# EAGLE schematic main_board (EAGLE 7.1.0)
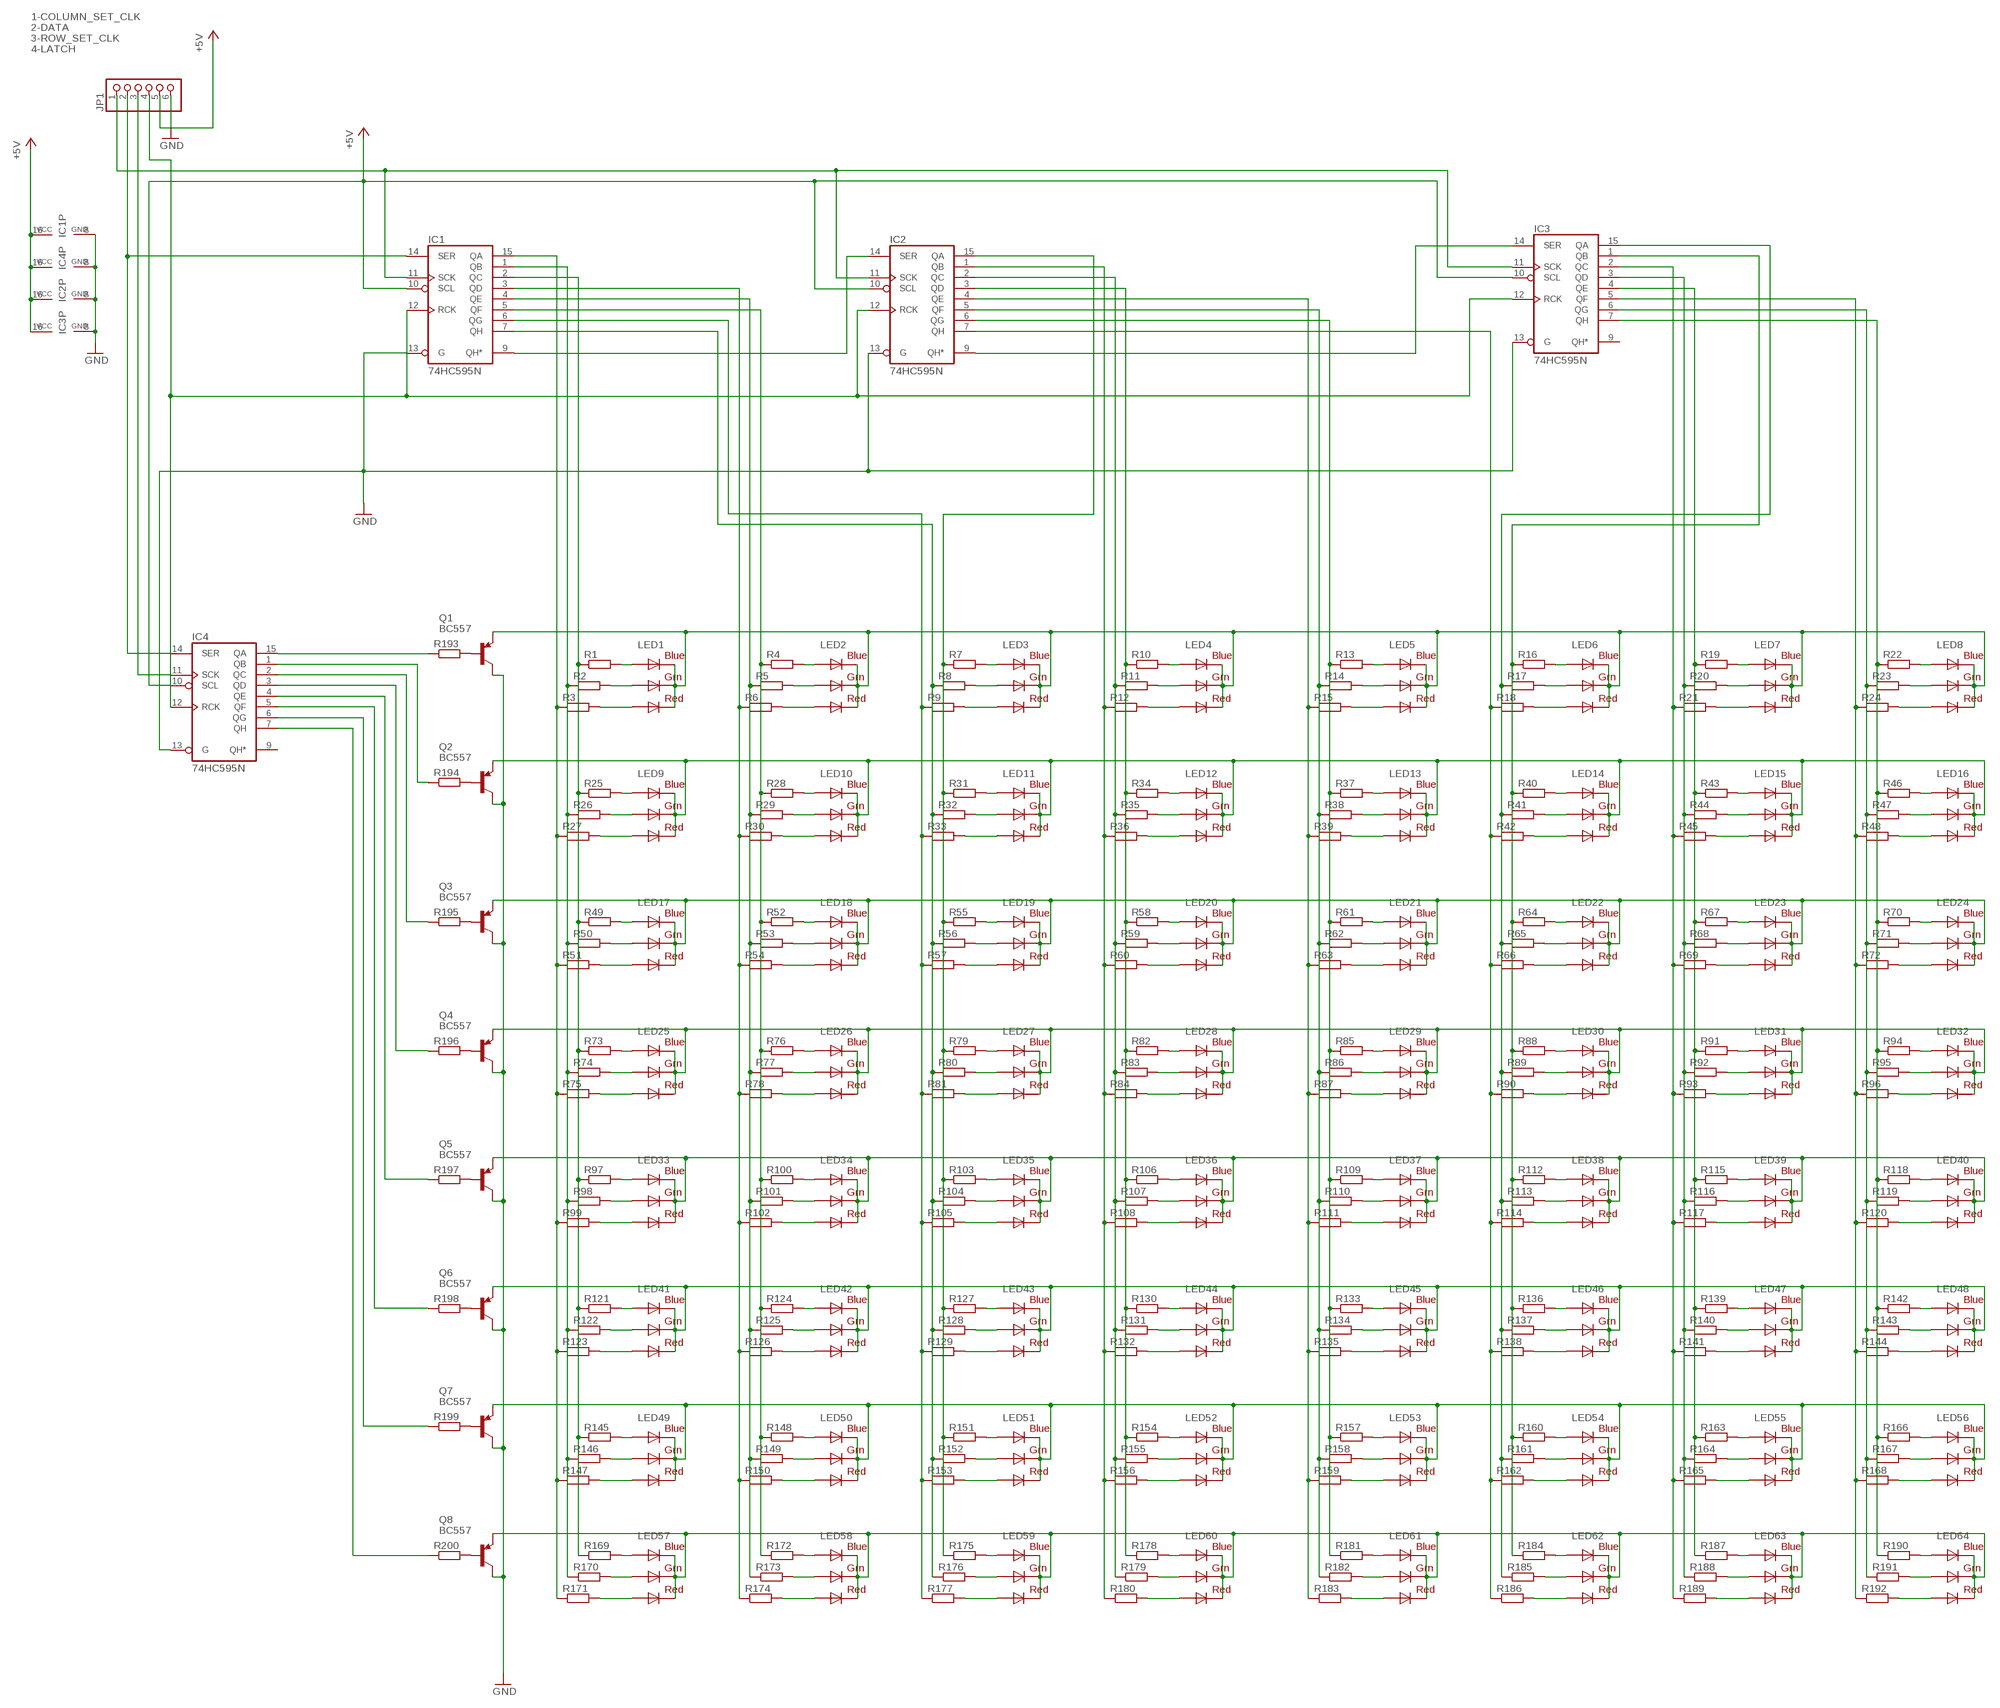
[diagram p0: schematic, sheet 1]

## Parts
IC1  74HC595N  [DIL16]
IC2  74HC595N  [DIL16]
IC3  74HC595N  [DIL16]
IC4  74HC595N  [DIL16]
JP1  PINHD-1X6  [1X06]
LED1  RGBLED5050  [RGBLED5050]
LED2  RGBLED5050  [RGBLED5050]
LED3  RGBLED5050  [RGBLED5050]
LED4  RGBLED5050  [RGBLED5050]
LED5  RGBLED5050  [RGBLED5050]
LED6  RGBLED5050  [RGBLED5050]
LED7  RGBLED5050  [RGBLED5050]
LED8  RGBLED5050  [RGBLED5050]
LED9  RGBLED5050  [RGBLED5050]
LED10  RGBLED5050  [RGBLED5050]
LED11  RGBLED5050  [RGBLED5050]
LED12  RGBLED5050  [RGBLED5050]
LED13  RGBLED5050  [RGBLED5050]
LED14  RGBLED5050  [RGBLED5050]
LED15  RGBLED5050  [RGBLED5050]
LED16  RGBLED5050  [RGBLED5050]
LED17  RGBLED5050  [RGBLED5050]
LED18  RGBLED5050  [RGBLED5050]
LED19  RGBLED5050  [RGBLED5050]
LED20  RGBLED5050  [RGBLED5050]
LED21  RGBLED5050  [RGBLED5050]
LED22  RGBLED5050  [RGBLED5050]
LED23  RGBLED5050  [RGBLED5050]
LED24  RGBLED5050  [RGBLED5050]
LED25  RGBLED5050  [RGBLED5050]
LED26  RGBLED5050  [RGBLED5050]
LED27  RGBLED5050  [RGBLED5050]
LED28  RGBLED5050  [RGBLED5050]
LED29  RGBLED5050  [RGBLED5050]
LED30  RGBLED5050  [RGBLED5050]
LED31  RGBLED5050  [RGBLED5050]
LED32  RGBLED5050  [RGBLED5050]
LED33  RGBLED5050  [RGBLED5050]
LED34  RGBLED5050  [RGBLED5050]
LED35  RGBLED5050  [RGBLED5050]
LED36  RGBLED5050  [RGBLED5050]
LED37  RGBLED5050  [RGBLED5050]
LED38  RGBLED5050  [RGBLED5050]
LED39  RGBLED5050  [RGBLED5050]
LED40  RGBLED5050  [RGBLED5050]
LED41  RGBLED5050  [RGBLED5050]
LED42  RGBLED5050  [RGBLED5050]
LED43  RGBLED5050  [RGBLED5050]
LED44  RGBLED5050  [RGBLED5050]
LED45  RGBLED5050  [RGBLED5050]
LED46  RGBLED5050  [RGBLED5050]
LED47  RGBLED5050  [RGBLED5050]
LED48  RGBLED5050  [RGBLED5050]
LED49  RGBLED5050  [RGBLED5050]
LED50  RGBLED5050  [RGBLED5050]
LED51  RGBLED5050  [RGBLED5050]
LED52  RGBLED5050  [RGBLED5050]
LED53  RGBLED5050  [RGBLED5050]
LED54  RGBLED5050  [RGBLED5050]
LED55  RGBLED5050  [RGBLED5050]
LED56  RGBLED5050  [RGBLED5050]
LED57  RGBLED5050  [RGBLED5050]
LED58  RGBLED5050  [RGBLED5050]
LED59  RGBLED5050  [RGBLED5050]
LED60  RGBLED5050  [RGBLED5050]
LED61  RGBLED5050  [RGBLED5050]
LED62  RGBLED5050  [RGBLED5050]
LED63  RGBLED5050  [RGBLED5050]
LED64  RGBLED5050  [RGBLED5050]
Q1  BC557  [TO92]
Q2  BC557  [TO92]
Q3  BC557  [TO92]
Q4  BC557  [TO92]
Q5  BC557  [TO92]
Q6  BC557  [TO92]
Q7  BC557  [TO92]
Q8  BC557  [TO92]
R1  R-EU_R0805  [R0805]
R2  R-EU_R0805  [R0805]
R3  R-EU_R0805  [R0805]
R4  R-EU_R0805  [R0805]
R5  R-EU_R0805  [R0805]
R6  R-EU_R0805  [R0805]
R7  R-EU_R0805  [R0805]
R8  R-EU_R0805  [R0805]
R9  R-EU_R0805  [R0805]
R10  R-EU_R0805  [R0805]
R11  R-EU_R0805  [R0805]
R12  R-EU_R0805  [R0805]
R13  R-EU_R0805  [R0805]
R14  R-EU_R0805  [R0805]
R15  R-EU_R0805  [R0805]
R16  R-EU_R0805  [R0805]
R17  R-EU_R0805  [R0805]
R18  R-EU_R0805  [R0805]
R19  R-EU_R0805  [R0805]
R20  R-EU_R0805  [R0805]
R21  R-EU_R0805  [R0805]
R22  R-EU_R0805  [R0805]
R23  R-EU_R0805  [R0805]
R24  R-EU_R0805  [R0805]
R25  R-EU_R0805  [R0805]
R26  R-EU_R0805  [R0805]
R27  R-EU_R0805  [R0805]
R28  R-EU_R0805  [R0805]
R29  R-EU_R0805  [R0805]
R30  R-EU_R0805  [R0805]
R31  R-EU_R0805  [R0805]
R32  R-EU_R0805  [R0805]
R33  R-EU_R0805  [R0805]
R34  R-EU_R0805  [R0805]
R35  R-EU_R0805  [R0805]
R36  R-EU_R0805  [R0805]
R37  R-EU_R0805  [R0805]
R38  R-EU_R0805  [R0805]
R39  R-EU_R0805  [R0805]
R40  R-EU_R0805  [R0805]
R41  R-EU_R0805  [R0805]
R42  R-EU_R0805  [R0805]
R43  R-EU_R0805  [R0805]
R44  R-EU_R0805  [R0805]
R45  R-EU_R0805  [R0805]
R46  R-EU_R0805  [R0805]
R47  R-EU_R0805  [R0805]
R48  R-EU_R0805  [R0805]
R49  R-EU_R0805  [R0805]
R50  R-EU_R0805  [R0805]
R51  R-EU_R0805  [R0805]
R52  R-EU_R0805  [R0805]
R53  R-EU_R0805  [R0805]
R54  R-EU_R0805  [R0805]
R55  R-EU_R0805  [R0805]
R56  R-EU_R0805  [R0805]
R57  R-EU_R0805  [R0805]
R58  R-EU_R0805  [R0805]
R59  R-EU_R0805  [R0805]
R60  R-EU_R0805  [R0805]
R61  R-EU_R0805  [R0805]
R62  R-EU_R0805  [R0805]
R63  R-EU_R0805  [R0805]
R64  R-EU_R0805  [R0805]
R65  R-EU_R0805  [R0805]
R66  R-EU_R0805  [R0805]
R67  R-EU_R0805  [R0805]
R68  R-EU_R0805  [R0805]
R69  R-EU_R0805  [R0805]
R70  R-EU_R0805  [R0805]
R71  R-EU_R0805  [R0805]
R72  R-EU_R0805  [R0805]
R73  R-EU_R0805  [R0805]
R74  R-EU_R0805  [R0805]
R75  R-EU_R0805  [R0805]
R76  R-EU_R0805  [R0805]
R77  R-EU_R0805  [R0805]
R78  R-EU_R0805  [R0805]
R79  R-EU_R0805  [R0805]
R80  R-EU_R0805  [R0805]
R81  R-EU_R0805  [R0805]
R82  R-EU_R0805  [R0805]
R83  R-EU_R0805  [R0805]
R84  R-EU_R0805  [R0805]
R85  R-EU_R0805  [R0805]
R86  R-EU_R0805  [R0805]
R87  R-EU_R0805  [R0805]
R88  R-EU_R0805  [R0805]
R89  R-EU_R0805  [R0805]
R90  R-EU_R0805  [R0805]
R91  R-EU_R0805  [R0805]
R92  R-EU_R0805  [R0805]
R93  R-EU_R0805  [R0805]
R94  R-EU_R0805  [R0805]
R95  R-EU_R0805  [R0805]
R96  R-EU_R0805  [R0805]
R97  R-EU_R0805  [R0805]
R98  R-EU_R0805  [R0805]
R99  R-EU_R0805  [R0805]
R100  R-EU_R0805  [R0805]
R101  R-EU_R0805  [R0805]
R102  R-EU_R0805  [R0805]
R103  R-EU_R0805  [R0805]
R104  R-EU_R0805  [R0805]
R105  R-EU_R0805  [R0805]
R106  R-EU_R0805  [R0805]
R107  R-EU_R0805  [R0805]
R108  R-EU_R0805  [R0805]
R109  R-EU_R0805  [R0805]
R110  R-EU_R0805  [R0805]
R111  R-EU_R0805  [R0805]
R112  R-EU_R0805  [R0805]
R113  R-EU_R0805  [R0805]
R114  R-EU_R0805  [R0805]
R115  R-EU_R0805  [R0805]
R116  R-EU_R0805  [R0805]
R117  R-EU_R0805  [R0805]
R118  R-EU_R0805  [R0805]
R119  R-EU_R0805  [R0805]
R120  R-EU_R0805  [R0805]
R121  R-EU_R0805  [R0805]
R122  R-EU_R0805  [R0805]
R123  R-EU_R0805  [R0805]
R124  R-EU_R0805  [R0805]
R125  R-EU_R0805  [R0805]
R126  R-EU_R0805  [R0805]
R127  R-EU_R0805  [R0805]
R128  R-EU_R0805  [R0805]
R129  R-EU_R0805  [R0805]
R130  R-EU_R0805  [R0805]
R131  R-EU_R0805  [R0805]
R132  R-EU_R0805  [R0805]
R133  R-EU_R0805  [R0805]
R134  R-EU_R0805  [R0805]
R135  R-EU_R0805  [R0805]
R136  R-EU_R0805  [R0805]
R137  R-EU_R0805  [R0805]
R138  R-EU_R0805  [R0805]
R139  R-EU_R0805  [R0805]
R140  R-EU_R0805  [R0805]
R141  R-EU_R0805  [R0805]
R142  R-EU_R0805  [R0805]
R143  R-EU_R0805  [R0805]
R144  R-EU_R0805  [R0805]
R145  R-EU_R0805  [R0805]
R146  R-EU_R0805  [R0805]
R147  R-EU_R0805  [R0805]
R148  R-EU_R0805  [R0805]
R149  R-EU_R0805  [R0805]
R150  R-EU_R0805  [R0805]
R151  R-EU_R0805  [R0805]
R152  R-EU_R0805  [R0805]
R153  R-EU_R0805  [R0805]
R154  R-EU_R0805  [R0805]
R155  R-EU_R0805  [R0805]
R156  R-EU_R0805  [R0805]
R157  R-EU_R0805  [R0805]
R158  R-EU_R0805  [R0805]
R159  R-EU_R0805  [R0805]
R160  R-EU_R0805  [R0805]
R161  R-EU_R0805  [R0805]
R162  R-EU_R0805  [R0805]
R163  R-EU_R0805  [R0805]
R164  R-EU_R0805  [R0805]
R165  R-EU_R0805  [R0805]
R166  R-EU_R0805  [R0805]
R167  R-EU_R0805  [R0805]
R168  R-EU_R0805  [R0805]
R169  R-EU_R0805  [R0805]
R170  R-EU_R0805  [R0805]
R171  R-EU_R0805  [R0805]
R172  R-EU_R0805  [R0805]
R173  R-EU_R0805  [R0805]
R174  R-EU_R0805  [R0805]
R175  R-EU_R0805  [R0805]
R176  R-EU_R0805  [R0805]
R177  R-EU_R0805  [R0805]
R178  R-EU_R0805  [R0805]
R179  R-EU_R0805  [R0805]
R180  R-EU_R0805  [R0805]
R181  R-EU_R0805  [R0805]
R182  R-EU_R0805  [R0805]
R183  R-EU_R0805  [R0805]
R184  R-EU_R0805  [R0805]
R185  R-EU_R0805  [R0805]
R186  R-EU_R0805  [R0805]
R187  R-EU_R0805  [R0805]
R188  R-EU_R0805  [R0805]
R189  R-EU_R0805  [R0805]
R190  R-EU_R0805  [R0805]
R191  R-EU_R0805  [R0805]
R192  R-EU_R0805  [R0805]
R193  R-EU_R0805  [R0805]
R194  R-EU_R0805  [R0805]
R195  R-EU_R0805  [R0805]
R196  R-EU_R0805  [R0805]
R197  R-EU_R0805  [R0805]
R198  R-EU_R0805  [R0805]
R199  R-EU_R0805  [R0805]
R200  R-EU_R0805  [R0805]

## Nets
1-COLUMN_SET_CLK: IC1.11(SCK) IC2.11(SCK) IC3.11(SCK) JP1.1
2-DATA: IC1.14(SER) IC4.14(SER) JP1.2
3-ROW_SET_CLK: IC4.11(SCK) JP1.3
4-LATCH: IC1.12(RCK) IC2.12(RCK) IC3.12(RCK) IC4.12(RCK) JP1.4
+5V: IC1.10(SCL) IC1.16(VCC) IC2.10(SCL) IC2.16(VCC) IC3.10(SCL) IC3.16(VCC) IC4.10(SCL) IC4.16(VCC) JP1.5
GND: IC1.8(GND) IC1.13(G) IC2.8(GND) IC2.13(G) IC3.8(GND) IC3.13(G) IC4.8(GND) IC4.13(G) JP1.6 Q1.3(C) Q2.3(C) Q3.3(C) Q4.3(C) Q5.3(C) Q6.3(C) Q7.3(C) Q8.3(C)
N$1: Q8.2(B) R200.2
N$3: LED57.3(BLUE_A) R169.2
N$4: LED57.1(GREEN_A) R170.2
N$5: LED57.2(RED_A) R171.2
N$6: LED58.3(BLUE_A) R172.2
N$8: LED58.1(GREEN_A) R173.2
N$9: IC2.2(QC) R11.1 R35.1 R59.1 R83.1 R107.1 R131.1 R155.1 R179.1
N$10: LED58.2(RED_A) R174.2
N$11: LED59.1(GREEN_A) R176.2
N$12: LED59.2(RED_A) R177.2
N$13: LED59.3(BLUE_A) R175.2
N$14: LED1.3(BLUE_A) R1.2
N$15: LED1.1(GREEN_A) R2.2
N$16: LED1.2(RED_A) R3.2
N$17: LED2.3(BLUE_A) R4.2
N$18: LED2.1(GREEN_A) R5.2
N$19: LED2.2(RED_A) R6.2
N$20: LED3.3(BLUE_A) R7.2
N$21: LED3.1(GREEN_A) R8.2
N$22: LED3.2(RED_A) R9.2
N$23: LED4.3(BLUE_A) R10.2
N$24: LED4.1(GREEN_A) R11.2
N$25: LED4.2(RED_A) R12.2
N$26: LED5.3(BLUE_A) R13.2
N$27: LED5.1(GREEN_A) R14.2
N$28: LED5.2(RED_A) R15.2
N$29: LED7.3(BLUE_A) R19.2
N$30: LED7.1(GREEN_A) R20.2
N$31: LED7.2(RED_A) R21.2
N$32: LED8.3(BLUE_A) R22.2
N$33: LED8.1(GREEN_A) R23.2
N$34: LED8.2(RED_A) R24.2
N$35: LED9.3(BLUE_A) R25.2
N$36: LED9.1(GREEN_A) R26.2
N$37: LED9.2(RED_A) R27.2
N$38: LED10.3(BLUE_A) R28.2
N$39: LED10.1(GREEN_A) R29.2
N$40: LED10.2(RED_A) R30.2
N$41: LED11.3(BLUE_A) R31.2
N$42: LED11.1(GREEN_A) R32.2
N$43: LED11.2(RED_A) R33.2
N$44: LED12.3(BLUE_A) R34.2
N$45: LED12.1(GREEN_A) R35.2
N$46: LED12.2(RED_A) R36.2
N$47: LED13.3(BLUE_A) R37.2
N$48: LED13.1(GREEN_A) R38.2
N$49: LED13.2(RED_A) R39.2
N$50: LED6.3(BLUE_A) R16.2
N$51: LED6.1(GREEN_A) R17.2
N$52: LED6.2(RED_A) R18.2
N$53: LED14.3(BLUE_A) R40.2
N$54: LED14.1(GREEN_A) R41.2
N$55: LED14.2(RED_A) R42.2
N$56: LED17.3(BLUE_A) R49.2
N$57: LED17.1(GREEN_A) R50.2
N$58: LED17.2(RED_A) R51.2
N$59: LED15.3(BLUE_A) R43.2
N$60: LED15.1(GREEN_A) R44.2
N$61: LED15.2(RED_A) R45.2
N$62: LED16.3(BLUE_A) R46.2
N$63: LED16.1(GREEN_A) R47.2
N$64: LED16.2(RED_A) R48.2
N$65: LED18.3(BLUE_A) R52.2
N$66: LED18.1(GREEN_A) R53.2
N$67: LED18.2(RED_A) R54.2
N$68: LED19.3(BLUE_A) R55.2
N$69: LED19.1(GREEN_A) R56.2
N$70: LED19.2(RED_A) R57.2
N$71: LED20.3(BLUE_A) R58.2
N$72: LED20.1(GREEN_A) R59.2
N$73: LED20.2(RED_A) R60.2
N$74: LED21.3(BLUE_A) R61.2
N$75: LED21.1(GREEN_A) R62.2
N$76: LED21.2(RED_A) R63.2
N$77: LED22.3(BLUE_A) R64.2
N$78: LED22.1(GREEN_A) R65.2
N$79: LED22.2(RED_A) R66.2
N$80: LED23.3(BLUE_A) R67.2
N$81: LED23.1(GREEN_A) R68.2
N$82: LED23.2(RED_A) R69.2
N$83: LED24.3(BLUE_A) R70.2
N$84: LED24.1(GREEN_A) R71.2
N$85: LED24.2(RED_A) R72.2
N$86: LED25.3(BLUE_A) R73.2
N$87: LED25.1(GREEN_A) R74.2
N$88: LED25.2(RED_A) R75.2
N$89: LED26.3(BLUE_A) R76.2
N$90: LED26.1(GREEN_A) R77.2
N$91: LED26.2(RED_A) R78.2
N$92: LED27.3(BLUE_A) R79.2
N$93: LED27.1(GREEN_A) R80.2
N$94: LED27.2(RED_A) R81.2
N$95: LED28.3(BLUE_A) R82.2
N$96: LED28.1(GREEN_A) R83.2
N$97: LED28.2(RED_A) R84.2
N$98: LED29.3(BLUE_A) R85.2
N$99: LED29.1(GREEN_A) R86.2
N$100: LED29.2(RED_A) R87.2
N$101: LED30.3(BLUE_A) R88.2
N$102: LED30.1(GREEN_A) R89.2
N$103: LED30.2(RED_A) R90.2
N$104: LED31.2(RED_A) R93.2
N$105: LED31.1(GREEN_A) R92.2
N$106: LED31.3(BLUE_A) R91.2
N$107: LED32.2(RED_A) R96.2
N$108: LED32.1(GREEN_A) R95.2
N$109: LED32.3(BLUE_A) R94.2
N$110: LED33.3(BLUE_A) R97.2
N$111: LED33.1(GREEN_A) R98.2
N$112: LED33.2(RED_A) R99.2
N$113: LED34.3(BLUE_A) R100.2
N$114: LED34.1(GREEN_A) R101.2
N$115: LED34.2(RED_A) R102.2
N$116: LED35.3(BLUE_A) R103.2
N$117: LED35.1(GREEN_A) R104.2
N$118: LED35.2(RED_A) R105.2
N$119: LED36.3(BLUE_A) R106.2
N$120: LED36.1(GREEN_A) R107.2
N$121: LED36.2(RED_A) R108.2
N$122: LED37.3(BLUE_A) R109.2
N$123: LED37.1(GREEN_A) R110.2
N$124: LED37.2(RED_A) R111.2
N$125: LED38.3(BLUE_A) R112.2
N$126: LED38.1(GREEN_A) R113.2
N$127: LED38.2(RED_A) R114.2
N$128: LED39.3(BLUE_A) R115.2
N$129: LED39.1(GREEN_A) R116.2
N$130: LED39.2(RED_A) R117.2
N$131: LED40.3(BLUE_A) R118.2
N$132: LED40.1(GREEN_A) R119.2
N$133: LED40.2(RED_A) R120.2
N$134: LED41.3(BLUE_A) R121.2
N$135: LED41.1(GREEN_A) R122.2
N$136: LED41.2(RED_A) R123.2
N$137: LED42.3(BLUE_A) R124.2
N$138: LED42.1(GREEN_A) R125.2
N$139: LED42.2(RED_A) R126.2
N$140: LED43.3(BLUE_A) R127.2
N$141: LED43.1(GREEN_A) R128.2
N$142: LED43.2(RED_A) R129.2
N$143: LED44.3(BLUE_A) R130.2
N$144: LED44.1(GREEN_A) R131.2
N$145: LED44.2(RED_A) R132.2
N$146: LED45.3(BLUE_A) R133.2
N$147: LED45.1(GREEN_A) R134.2
N$148: LED45.2(RED_A) R135.2
N$149: LED46.3(BLUE_A) R136.2
N$150: LED46.1(GREEN_A) R137.2
N$151: LED46.2(RED_A) R138.2
N$152: LED47.3(BLUE_A) R139.2
N$153: LED47.1(GREEN_A) R140.2
N$154: LED47.2(RED_A) R141.2
N$155: LED48.3(BLUE_A) R142.2
N$156: LED48.1(GREEN_A) R143.2
N$157: LED48.2(RED_A) R144.2
N$158: LED49.3(BLUE_A) R145.2
N$159: LED49.1(GREEN_A) R146.2
N$160: LED49.2(RED_A) R147.2
N$161: LED50.3(BLUE_A) R148.2
N$162: LED50.1(GREEN_A) R149.2
N$163: LED50.2(RED_A) R150.2
N$164: LED51.3(BLUE_A) R151.2
N$165: LED51.1(GREEN_A) R152.2
N$166: LED51.2(RED_A) R153.2
N$167: LED52.3(BLUE_A) R154.2
N$168: LED52.1(GREEN_A) R155.2
N$169: LED52.2(RED_A) R156.2
N$170: LED53.3(BLUE_A) R157.2
N$171: LED53.1(GREEN_A) R158.2
N$172: LED53.2(RED_A) R159.2
N$173: LED54.3(BLUE_A) R160.2
N$174: LED54.1(GREEN_A) R161.2
N$175: LED54.2(RED_A) R162.2
N$176: LED55.3(BLUE_A) R163.2
N$177: LED55.1(GREEN_A) R164.2
N$178: LED55.2(RED_A) R165.2
N$179: LED56.3(BLUE_A) R166.2
N$180: LED56.1(GREEN_A) R167.2
N$181: LED56.2(RED_A) R168.2
N$182: LED60.3(BLUE_A) R178.2
N$183: LED60.1(GREEN_A) R179.2
N$184: LED60.2(RED_A) R180.2
N$185: LED61.3(BLUE_A) R181.2
N$186: LED61.1(GREEN_A) R182.2
N$187: LED61.2(RED_A) R183.2
N$188: LED62.3(BLUE_A) R184.2
N$189: LED62.1(GREEN_A) R185.2
N$190: LED62.2(RED_A) R186.2
N$191: LED63.3(BLUE_A) R187.2
N$192: LED63.1(GREEN_A) R188.2
N$193: LED63.2(RED_A) R189.2
N$194: LED64.3(BLUE_A) R190.2
N$195: LED64.1(GREEN_A) R191.2
N$196: LED64.2(RED_A) R192.2
N$197: LED1.4(BLUE_C) LED1.5(RED_C) LED1.6(GREEN_C) LED2.4(BLUE_C) LED2.5(RED_C) LED2.6(GREEN_C) LED3.4(BLUE_C) LED3.5(RED_C) LED3.6(GREEN_C) LED4.4(BLUE_C) LED4.5(RED_C) LED4.6(GREEN_C) LED5.4(BLUE_C) LED5.5(RED_C) LED5.6(GREEN_C) LED6.4(BLUE_C) LED6.5(RED_C) LED6.6(GREEN_C) LED7.4(BLUE_C) LED7.5(RED_C) LED7.6(GREEN_C) LED8.4(BLUE_C) LED8.5(RED_C) LED8.6(GREEN_C) Q1.1(E)
N$198: LED17.4(BLUE_C) LED17.5(RED_C) LED17.6(GREEN_C) LED18.4(BLUE_C) LED18.5(RED_C) LED18.6(GREEN_C) LED19.4(BLUE_C) LED19.5(RED_C) LED19.6(GREEN_C) LED20.4(BLUE_C) LED20.5(RED_C) LED20.6(GREEN_C) LED21.4(BLUE_C) LED21.5(RED_C) LED21.6(GREEN_C) LED22.4(BLUE_C) LED22.5(RED_C) LED22.6(GREEN_C) LED23.4(BLUE_C) LED23.5(RED_C) LED23.6(GREEN_C) LED24.4(BLUE_C) LED24.5(RED_C) LED24.6(GREEN_C) Q3.1(E)
N$199: Q2.2(B) R194.2
N$200: LED9.4(BLUE_C) LED9.5(RED_C) LED9.6(GREEN_C) LED10.4(BLUE_C) LED10.5(RED_C) LED10.6(GREEN_C) LED11.4(BLUE_C) LED11.5(RED_C) LED11.6(GREEN_C) LED12.4(BLUE_C) LED12.5(RED_C) LED12.6(GREEN_C) LED13.4(BLUE_C) LED13.5(RED_C) LED13.6(GREEN_C) LED14.4(BLUE_C) LED14.5(RED_C) LED14.6(GREEN_C) LED15.4(BLUE_C) LED15.5(RED_C) LED15.6(GREEN_C) LED16.4(BLUE_C) LED16.5(RED_C) LED16.6(GREEN_C) Q2.1(E)
N$201: IC4.4(QE) R197.1
N$202: LED41.4(BLUE_C) LED41.5(RED_C) LED41.6(GREEN_C) LED42.4(BLUE_C) LED42.5(RED_C) LED42.6(GREEN_C) LED43.4(BLUE_C) LED43.5(RED_C) LED43.6(GREEN_C) LED44.4(BLUE_C) LED44.5(RED_C) LED44.6(GREEN_C) LED45.4(BLUE_C) LED45.5(RED_C) LED45.6(GREEN_C) LED46.4(BLUE_C) LED46.5(RED_C) LED46.6(GREEN_C) LED47.4(BLUE_C) LED47.5(RED_C) LED47.6(GREEN_C) LED48.4(BLUE_C) LED48.5(RED_C) LED48.6(GREEN_C) Q6.1(E)
N$203: IC4.6(QG) R199.1
N$204: IC4.7(QH) R200.1
N$205: IC4.2(QC) R195.1
N$206: LED25.4(BLUE_C) LED25.5(RED_C) LED25.6(GREEN_C) LED26.4(BLUE_C) LED26.5(RED_C) LED26.6(GREEN_C) LED27.4(BLUE_C) LED27.5(RED_C) LED27.6(GREEN_C) LED28.4(BLUE_C) LED28.5(RED_C) LED28.6(GREEN_C) LED29.4(BLUE_C) LED29.5(RED_C) LED29.6(GREEN_C) LED30.4(BLUE_C) LED30.5(RED_C) LED30.6(GREEN_C) LED31.4(BLUE_C) LED31.5(RED_C) LED31.6(GREEN_C) LED32.4(BLUE_C) LED32.5(RED_C) LED32.6(GREEN_C) Q4.1(E)
N$207: IC1.15(QA) R3.1 R27.1 R51.1 R75.1 R99.1 R123.1 R147.1 R171.1
N$208: IC4.1(QB) R194.1
N$209: IC4.3(QD) R196.1
N$210: LED33.4(BLUE_C) LED33.5(RED_C) LED33.6(GREEN_C) LED34.4(BLUE_C) LED34.5(RED_C) LED34.6(GREEN_C) LED35.4(BLUE_C) LED35.5(RED_C) LED35.6(GREEN_C) LED36.4(BLUE_C) LED36.5(RED_C) LED36.6(GREEN_C) LED37.4(BLUE_C) LED37.5(RED_C) LED37.6(GREEN_C) LED38.4(BLUE_C) LED38.5(RED_C) LED38.6(GREEN_C) LED39.4(BLUE_C) LED39.5(RED_C) LED39.6(GREEN_C) LED40.4(BLUE_C) LED40.5(RED_C) LED40.6(GREEN_C) Q5.1(E)
N$211: IC1.1(QB) R2.1 R26.1 R50.1 R74.1 R98.1 R122.1 R146.1 R170.1
N$212: IC1.2(QC) R1.1 R25.1 R49.1 R73.1 R97.1 R121.1 R145.1 R169.1
N$213: IC1.3(QD) R6.1 R30.1 R54.1 R78.1 R102.1 R126.1 R150.1 R174.1
N$214: LED57.4(BLUE_C) LED57.5(RED_C) LED57.6(GREEN_C) LED58.4(BLUE_C) LED58.5(RED_C) LED58.6(GREEN_C) LED59.4(BLUE_C) LED59.5(RED_C) LED59.6(GREEN_C) LED60.4(BLUE_C) LED60.5(RED_C) LED60.6(GREEN_C) LED61.4(BLUE_C) LED61.5(RED_C) LED61.6(GREEN_C) LED62.4(BLUE_C) LED62.5(RED_C) LED62.6(GREEN_C) LED63.4(BLUE_C) LED63.5(RED_C) LED63.6(GREEN_C) LED64.4(BLUE_C) LED64.5(RED_C) LED64.6(GREEN_C) Q8.1(E)
N$215: IC4.5(QF) R198.1
N$216: LED49.4(BLUE_C) LED49.5(RED_C) LED49.6(GREEN_C) LED50.4(BLUE_C) LED50.5(RED_C) LED50.6(GREEN_C) LED51.4(BLUE_C) LED51.5(RED_C) LED51.6(GREEN_C) LED52.4(BLUE_C) LED52.5(RED_C) LED52.6(GREEN_C) LED53.4(BLUE_C) LED53.5(RED_C) LED53.6(GREEN_C) LED54.4(BLUE_C) LED54.5(RED_C) LED54.6(GREEN_C) LED55.4(BLUE_C) LED55.5(RED_C) LED55.6(GREEN_C) LED56.4(BLUE_C) LED56.5(RED_C) LED56.6(GREEN_C) Q7.1(E)
N$217: IC1.4(QE) R5.1 R29.1 R53.1 R77.1 R101.1 R125.1 R149.1 R173.1
N$218: IC1.5(QF) R4.1 R28.1 R52.1 R76.1 R100.1 R124.1 R148.1 R172.1
N$219: IC1.6(QG) R9.1 R33.1 R57.1 R81.1 R105.1 R129.1 R153.1 R177.1
N$220: IC1.7(QH) R8.1 R32.1 R56.1 R80.1 R104.1 R128.1 R152.1 R176.1
N$221: IC2.15(QA) R7.1 R31.1 R55.1 R79.1 R103.1 R127.1 R151.1 R175.1
N$222: IC2.7(QH) R18.1 R42.1 R66.1 R90.1 R114.1 R138.1 R162.1 R186.1
N$223: IC2.3(QD) R10.1 R34.1 R58.1 R82.1 R106.1 R130.1 R154.1 R178.1
N$224: IC2.1(QB) R12.1 R36.1 R60.1 R84.1 R108.1 R132.1 R156.1 R180.1
N$225: IC2.4(QE) R15.1 R39.1 R63.1 R87.1 R111.1 R135.1 R159.1 R183.1
N$226: IC2.5(QF) R14.1 R38.1 R62.1 R86.1 R110.1 R134.1 R158.1 R182.1
N$227: IC2.6(QG) R13.1 R37.1 R61.1 R85.1 R109.1 R133.1 R157.1 R181.1
N$228: IC3.15(QA) R17.1 R41.1 R65.1 R89.1 R113.1 R137.1 R161.1 R185.1
N$229: IC3.1(QB) R16.1 R40.1 R64.1 R88.1 R112.1 R136.1 R160.1 R184.1
N$230: IC3.2(QC) R21.1 R45.1 R69.1 R93.1 R117.1 R141.1 R165.1 R189.1
N$231: IC3.3(QD) R20.1 R44.1 R68.1 R92.1 R116.1 R140.1 R164.1 R188.1
N$232: IC3.4(QE) R19.1 R43.1 R67.1 R91.1 R115.1 R139.1 R163.1 R187.1
N$233: IC3.5(QF) R24.1 R48.1 R72.1 R96.1 R120.1 R144.1 R168.1 R192.1
N$234: IC3.6(QG) R23.1 R47.1 R71.1 R95.1 R119.1 R143.1 R167.1 R191.1
N$235: IC3.7(QH) R22.1 R46.1 R70.1 R94.1 R118.1 R142.1 R166.1 R190.1
N$236: IC2.9(QH*) IC3.14(SER)
N$239: Q3.2(B) R195.2
N$240: IC1.9(QH*) IC2.14(SER)
N$241: Q4.2(B) R196.2
N$242: Q5.2(B) R197.2
N$243: Q6.2(B) R198.2
N$244: Q7.2(B) R199.2
N$245: IC4.15(QA) R193.1
N$246: Q1.2(B) R193.2
Unconnected: IC3.9(QH*) IC4.9(QH*)

## Library data of the parts
IC1-IC4 = 74xx-eu:74*595: 8-bit SHIFT REGISTER, output latch
JP1 = pinhead:PINHD-1X6: PIN HEADER
LED1-LED64 = adafruit:RGBLED: For 5050 RGB LEDs, the order of the LEDs may vary from one manufacturer to another!
Q1-Q8 = transistor-pnp:BC557: PNP Transistor
R1-R200 = rcl:R-EU_: RESISTOR, European symbol